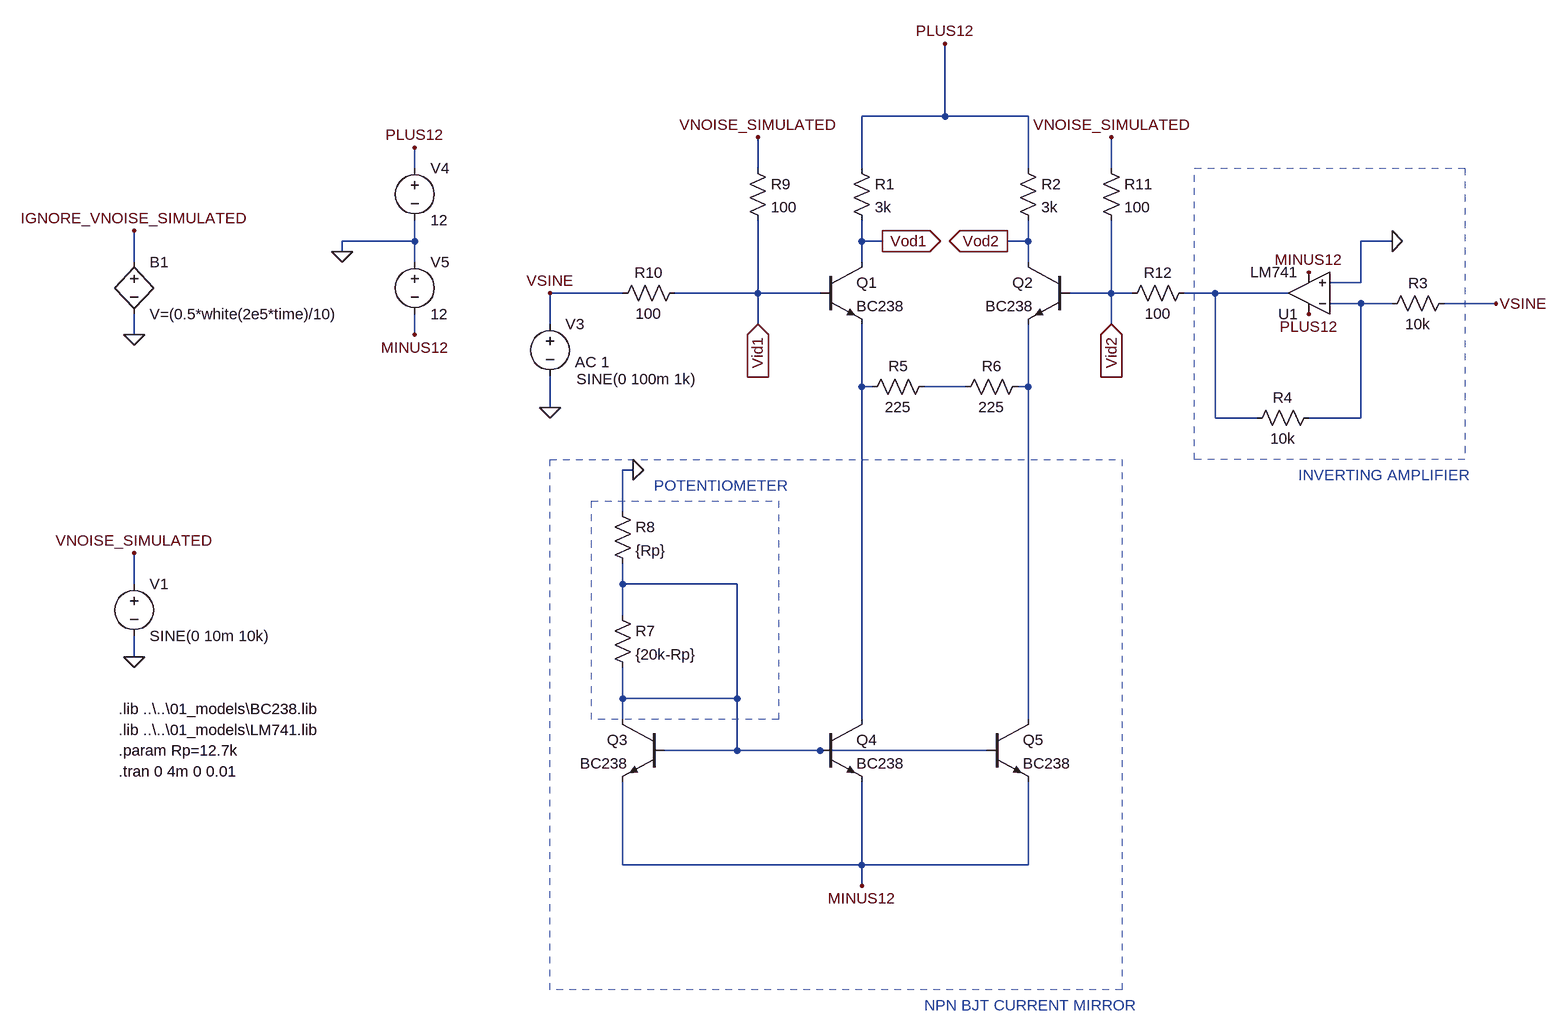
[diagram p0: schematic 03_diff_amp_tail_cur_mirror_20201213_2225.asc]
03_diff_amp_tail_cur_mirror_20201213_2225.asc, the LTspice schematic file:
Version 4
SHEET 1 1632 1324
WIRE 256 -128 256 -240
WIRE 256 -128 128 -128
WIRE 384 -128 256 -128
WIRE -560 -48 -560 -80
WIRE -32 -48 -32 -96
WIRE 128 -48 128 -128
WIRE 384 -48 384 -128
WIRE 512 -48 512 -96
WIRE -560 64 -560 32
WIRE -560 64 -672 64
WIRE 128 64 128 32
WIRE 160 64 128 64
WIRE 384 64 384 32
WIRE 384 64 352 64
WIRE 944 64 896 64
WIRE -672 80 -672 64
WIRE -992 96 -992 48
WIRE -560 96 -560 64
WIRE 128 96 128 64
WIRE 384 96 384 64
WIRE 896 128 896 64
WIRE 896 128 848 128
WIRE -240 144 -352 144
WIRE -32 144 -32 32
WIRE -32 144 -160 144
WIRE 64 144 -32 144
WIRE 512 144 512 32
WIRE 512 144 448 144
WIRE 544 144 512 144
WIRE 672 144 624 144
WIRE 784 144 672 144
WIRE 896 160 848 160
WIRE 944 160 896 160
WIRE 1104 160 1024 160
WIRE -352 192 -352 144
WIRE -32 192 -32 144
WIRE 512 192 512 144
WIRE -992 208 -992 176
WIRE -560 208 -560 176
WIRE 128 288 128 192
WIRE 144 288 128 288
WIRE 288 288 224 288
WIRE 384 288 384 192
WIRE 384 288 368 288
WIRE -352 320 -352 272
WIRE 672 336 672 144
WIRE 736 336 672 336
WIRE 896 336 896 160
WIRE 896 336 816 336
WIRE -224 416 -240 416
WIRE -240 480 -240 416
WIRE -992 592 -992 544
WIRE -240 592 -240 560
WIRE -64 592 -240 592
WIRE -240 640 -240 592
WIRE -992 704 -992 672
WIRE -240 768 -240 720
WIRE -64 768 -64 592
WIRE -64 768 -240 768
WIRE -240 800 -240 768
WIRE 128 800 128 288
WIRE 384 800 384 288
WIRE -64 848 -64 768
WIRE -64 848 -176 848
WIRE 64 848 -64 848
WIRE 320 848 64 848
WIRE -240 1024 -240 896
WIRE 128 1024 128 896
WIRE 128 1024 -240 1024
WIRE 384 1024 384 896
WIRE 384 1024 128 1024
WIRE 128 1056 128 1024
FLAG -992 208 0
FLAG -352 320 0
FLAG 944 64 0
FLAG -672 80 0
FLAG -560 -80 PLUS12
FLAG -560 208 MINUS12
FLAG 816 112 MINUS12
FLAG 816 176 PLUS12
FLAG -224 416 0
FLAG 128 1056 MINUS12
FLAG 256 -240 PLUS12
FLAG -352 144 VSINE
FLAG 1104 160 VSINE
FLAG -992 48 IGNORE_VNOISE_SIMULATED
FLAG -32 -96 VNOISE_SIMULATED
FLAG 512 -96 VNOISE_SIMULATED
FLAG -992 704 0
FLAG -992 544 VNOISE_SIMULATED
FLAG 160 64 Vod1
IOPIN 160 64 Out
FLAG 352 64 Vod2
IOPIN 352 64 Out
FLAG -32 192 Vid1
IOPIN -32 192 In
FLAG 512 192 Vid2
IOPIN 512 192 In
SYMBOL res 112 -64 R0
SYMATTR InstName R1
SYMATTR Value 3k
SYMBOL res 368 -64 R0
SYMATTR InstName R2
SYMATTR Value 3k
SYMBOL voltage -352 176 R0
WINDOW 3 41 100 Left 2
WINDOW 123 39 74 Left 2
WINDOW 39 0 0 Left 2
SYMATTR Value SINE(0 100m 1k)
SYMATTR Value2 AC 1
SYMATTR InstName V3
SYMBOL OpAmps\\opamp2 816 208 R180
SYMATTR InstName U1
SYMATTR Value LM741
SYMBOL res 1040 144 R90
WINDOW 0 0 56 VBottom 2
WINDOW 3 32 56 VTop 2
SYMATTR InstName R3
SYMATTR Value 10k
SYMBOL res 832 320 R90
WINDOW 0 0 56 VBottom 2
WINDOW 3 32 56 VTop 2
SYMATTR InstName R4
SYMATTR Value 10k
SYMBOL voltage -560 -64 R0
SYMATTR InstName V4
SYMATTR Value 12
SYMBOL voltage -560 80 R0
SYMATTR InstName V5
SYMATTR Value 12
SYMBOL npn 64 96 R0
SYMATTR InstName Q1
SYMATTR Value BC238
SYMBOL res 240 272 R90
WINDOW 0 0 56 VBottom 2
WINDOW 3 32 56 VTop 2
SYMATTR InstName R5
SYMATTR Value 225
SYMBOL res 384 272 R90
WINDOW 0 0 56 VBottom 2
WINDOW 3 32 56 VTop 2
SYMATTR InstName R6
SYMATTR Value 225
SYMBOL res -256 624 R0
SYMATTR InstName R7
SYMATTR Value {20k-Rp}
SYMBOL res -256 464 R0
SYMATTR InstName R8
SYMATTR Value {Rp}
SYMBOL npn -176 800 M0
SYMATTR InstName Q3
SYMATTR Value BC238
SYMBOL npn 64 800 R0
SYMATTR InstName Q4
SYMATTR Value BC238
SYMBOL npn 320 800 R0
SYMATTR InstName Q5
SYMATTR Value BC238
SYMBOL res -48 -64 R0
SYMATTR InstName R9
SYMATTR Value 100
SYMBOL res -144 128 R90
WINDOW 0 0 56 VBottom 2
WINDOW 3 32 56 VTop 2
SYMATTR InstName R10
SYMATTR Value 100
SYMBOL res 496 -64 R0
SYMATTR InstName R11
SYMATTR Value 100
SYMBOL res 640 128 R90
WINDOW 0 0 56 VBottom 2
WINDOW 3 32 56 VTop 2
SYMATTR InstName R12
SYMATTR Value 100
SYMBOL npn 448 96 M0
SYMATTR InstName Q2
SYMATTR Value BC238
SYMBOL bv -992 80 R0
SYMATTR InstName B1
SYMATTR Value V=(0.5*white(2e5*time)/10)
SYMBOL voltage -992 576 R0
WINDOW 123 0 0 Left 0
WINDOW 39 0 0 Left 0
SYMATTR InstName V1
SYMATTR Value SINE(0 10m 10k)
TEXT -1016 816 Left 2 !.lib ..\\..\\01_models\\LM741.lib
TEXT -1016 880 Left 2 !.tran 0 4m 0 0.01
TEXT -1016 784 Left 2 !.lib ..\\..\\01_models\\BC238.lib
TEXT -1016 848 Left 2 !.param Rp=12.7k
TEXT 224 1240 Left 2 ;NPN BJT CURRENT MIRROR
TEXT 800 424 Left 2 ;INVERTING AMPLIFIER
TEXT -192 440 Left 2 ;POTENTIOMETER
RECTANGLE Normal 0 800 -288 464 1
RECTANGLE Normal 528 1216 -352 400 1
RECTANGLE Normal 1056 400 640 -48 1

The netlist it stands for:
* 03_diff_amp_tail_cur_mirror_20201213_2225.asc
R1 PLUS12 Vod1 3k
R2 PLUS12 Vod2 3k
V3 VSINE 0 SINE(0 100m 1k) AC 1
XU1 0 N002 PLUS12 MINUS12 N001 LM741  ; pins In+ In- V+ V- OUT
R3 VSINE N002 10k
R4 N002 N001 10k
V4 PLUS12 0 12
V5 0 MINUS12 12
Q1 Vod1 Vid1 N003 0 BC238
R5 N004 N003 225
R6 N005 N004 225
R7 N006 N006 {20k-Rp}
R8 0 N006 {Rp}
Q3 N006 N006 MINUS12 0 BC238
Q4 N003 N006 MINUS12 0 BC238
Q5 N005 N006 MINUS12 0 BC238
R9 VNOISE_SIMULATED Vid1 100
R10 Vid1 VSINE 100
R11 VNOISE_SIMULATED Vid2 100
R12 N001 Vid2 100
Q2 Vod2 Vid2 N005 0 BC238
B1 IGNORE_VNOISE_SIMULATED 0 V=(0.5*white(2e5*time)/10)
V1 VNOISE_SIMULATED 0 SINE(0 10m 10k)
.model NPN NPN
.model PNP PNP
.lib standard.bjt
.lib ..\..\01_models\LM741.lib
.tran 0 4m 0 0.01
.lib ..\..\01_models\BC238.lib
.param Rp=12.7k
* NPN BJT CURRENT MIRROR
* INVERTING AMPLIFIER
* POTENTIOMETER
.backanno
.end